# Altium schematic sheet PDMC-S06-V00-Connector.SchDoc: Connectors
size A3; DrawnBy: Zoe Goodward; Organization: QUT Motorsport; Address1: O-120, Gardens Point; Address2: 2 George Street; Address3: Brisbane, QLD 4000; Address4: Australia; DocumentNumber: 6; Revision: 01; SheetNumber: 6; SheetTotal: 6; Version: 01; Project: Power Distribution Module Card; PageSetup: Record=PageOptions|CenterHorizontal=True|CenterVertical=True|PrintScale=0.97|XCorrection=1.00|YCorrection=1.00|PrintKind=0|BorderSize=5000000|LeftOffset=0|BottomOffset=0|Orientation=2|PaperLength=1000|PaperWidth=1000|Scale=100|PaperSource=7|PrintQuality=-4|MediaType=1|DitherType=10|PaperKind=A4|PrintScaleMode=1
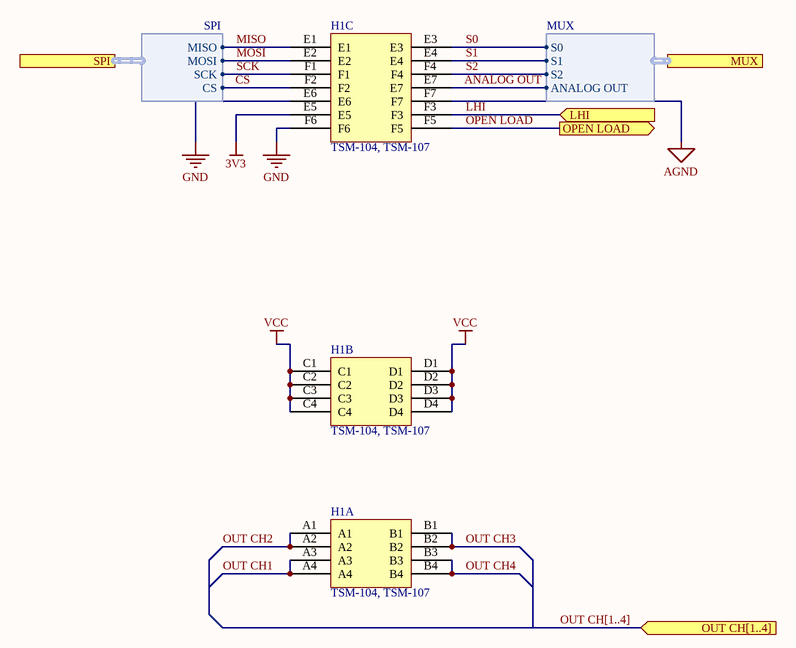
[diagram p0: PDMC-S06-V00-Connector.SchDoc]

## Parts
H1  TSM-104, TSM-107  [TSM-104, TSM-107]  (parts A,B,C of 3)

## Ports
LHI (in), MUX (harness MUX), OPEN LOAD (out), OUT CH[1..4] (in), SPI (harness SPI)

## Harnesses
MUX: ANALOG OUT, S0, S1, S2
SPI: MOSI, MISO, SCK, CS

## Nets
3V3: H1.E5
AGND: H1.F7
GND: H1.E6 H1.F6
VCC: H1.C1 H1.C2 H1.C3 H1.C4 H1.D1 H1.D2 H1.D3 H1.D4
ANALOG OUT: H1.E7 ; port MUX.ANALOG OUT
CS: H1.F2 ; port SPI.CS
LHI: H1.F3 ; port LHI
MISO: H1.E1 ; port SPI.MISO
MOSI: H1.E2 ; port SPI.MOSI
OPEN LOAD: H1.F5 ; port OPEN LOAD
OUT CH1: H1.A3 H1.A4
OUT CH2: H1.A1 H1.A2
OUT CH3: H1.B1 H1.B2
OUT CH4: H1.B3 H1.B4
S0: H1.E3 ; port MUX.S0
S1: H1.E4 ; port MUX.S1
S2: H1.F4 ; port MUX.S2
SCK: H1.F1 ; port SPI.SCK

## Buses and harness runs
bus OUT CH[1..4] = port OUT CH[1..4]

## Notes on the sheet
- Revision History:
- Sheet Title:
- Rev
- Date
- Description
- Project:
- Size:
- Drawn By:
- A3
- Number:
- Revision:
- Sheet
- Version:
- of
- QUT Motorsport
- O-120, Gardens Point
- 2 George Street
- Brisbane, QLD 4000
- Australia
- Print Date:
- Print Time:
- File Name:

## Library data of the parts
H1 = TSM-104, TSM-107: CONN HEADER SMD R/A 8POS and 14POS 2.54MM; ComponentLink1Description: Digikey; ComponentLink1URL: https://www.digikey.com.au/product-detail/en/samtec-inc/TSM-104-01-L-DH/SAM10277-ND/6679014; ComponentLink2Description: Digikey; ComponentLink2URL: https://www.digikey.com.au/product-detail/en/samtec-inc/TSM-107-01-L-DH/SAM15902-ND/7638593; ComponentLink3Description: Datasheet; ComponentLink3URL: http://suddendocs.samtec.com/catalog_english/tsm.pdf